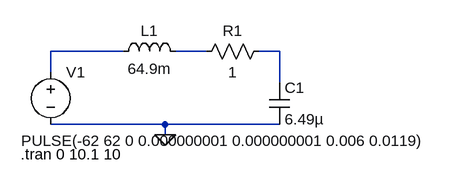
[diagram p0: schematic 5lab_01.asc]
5lab_01.asc, the LTspice schematic file:
Version 4
SHEET 1 880 680
WIRE 80 80 -32 80
WIRE 208 80 160 80
WIRE 320 80 288 80
WIRE -32 112 -32 80
WIRE 320 128 320 80
WIRE 144 192 -32 192
WIRE 320 192 144 192
WIRE 144 208 144 192
FLAG 144 208 0
SYMBOL voltage -32 96 R0
WINDOW 3 -45 121 Left 2
WINDOW 123 0 0 Left 0
WINDOW 39 0 0 Left 0
SYMATTR InstName V1
SYMATTR Value PULSE(-62 62 0 0.000000001 0.000000001 0.006 0.0119)
SYMBOL ind 64 96 R270
WINDOW 0 32 56 VTop 2
WINDOW 3 5 56 VBottom 2
SYMATTR InstName L1
SYMATTR Value 64.9m
SYMBOL res 304 64 R90
WINDOW 0 0 56 VBottom 2
WINDOW 3 32 56 VTop 2
SYMATTR InstName R1
SYMATTR Value 1
SYMBOL cap 304 128 R0
SYMATTR InstName C1
SYMATTR Value 6.49µ
TEXT -78 238 Left 2 !.tran 0 10.1 10

The netlist it stands for:
* 5lab_01.asc
V1 N001 0 PULSE(-62 62 0 0.000000001 0.000000001 0.006 0.0119)
L1 N001 N002 64.9m
R1 N003 N002 1
C1 N003 0 6.49µ
.tran 0 10.1 10
.backanno
.end